# EAGLE schematic cape (EAGLE 9.4.2)
Recording and Emulation of Energy Harvesting Traces

## Sheet 1 of 8
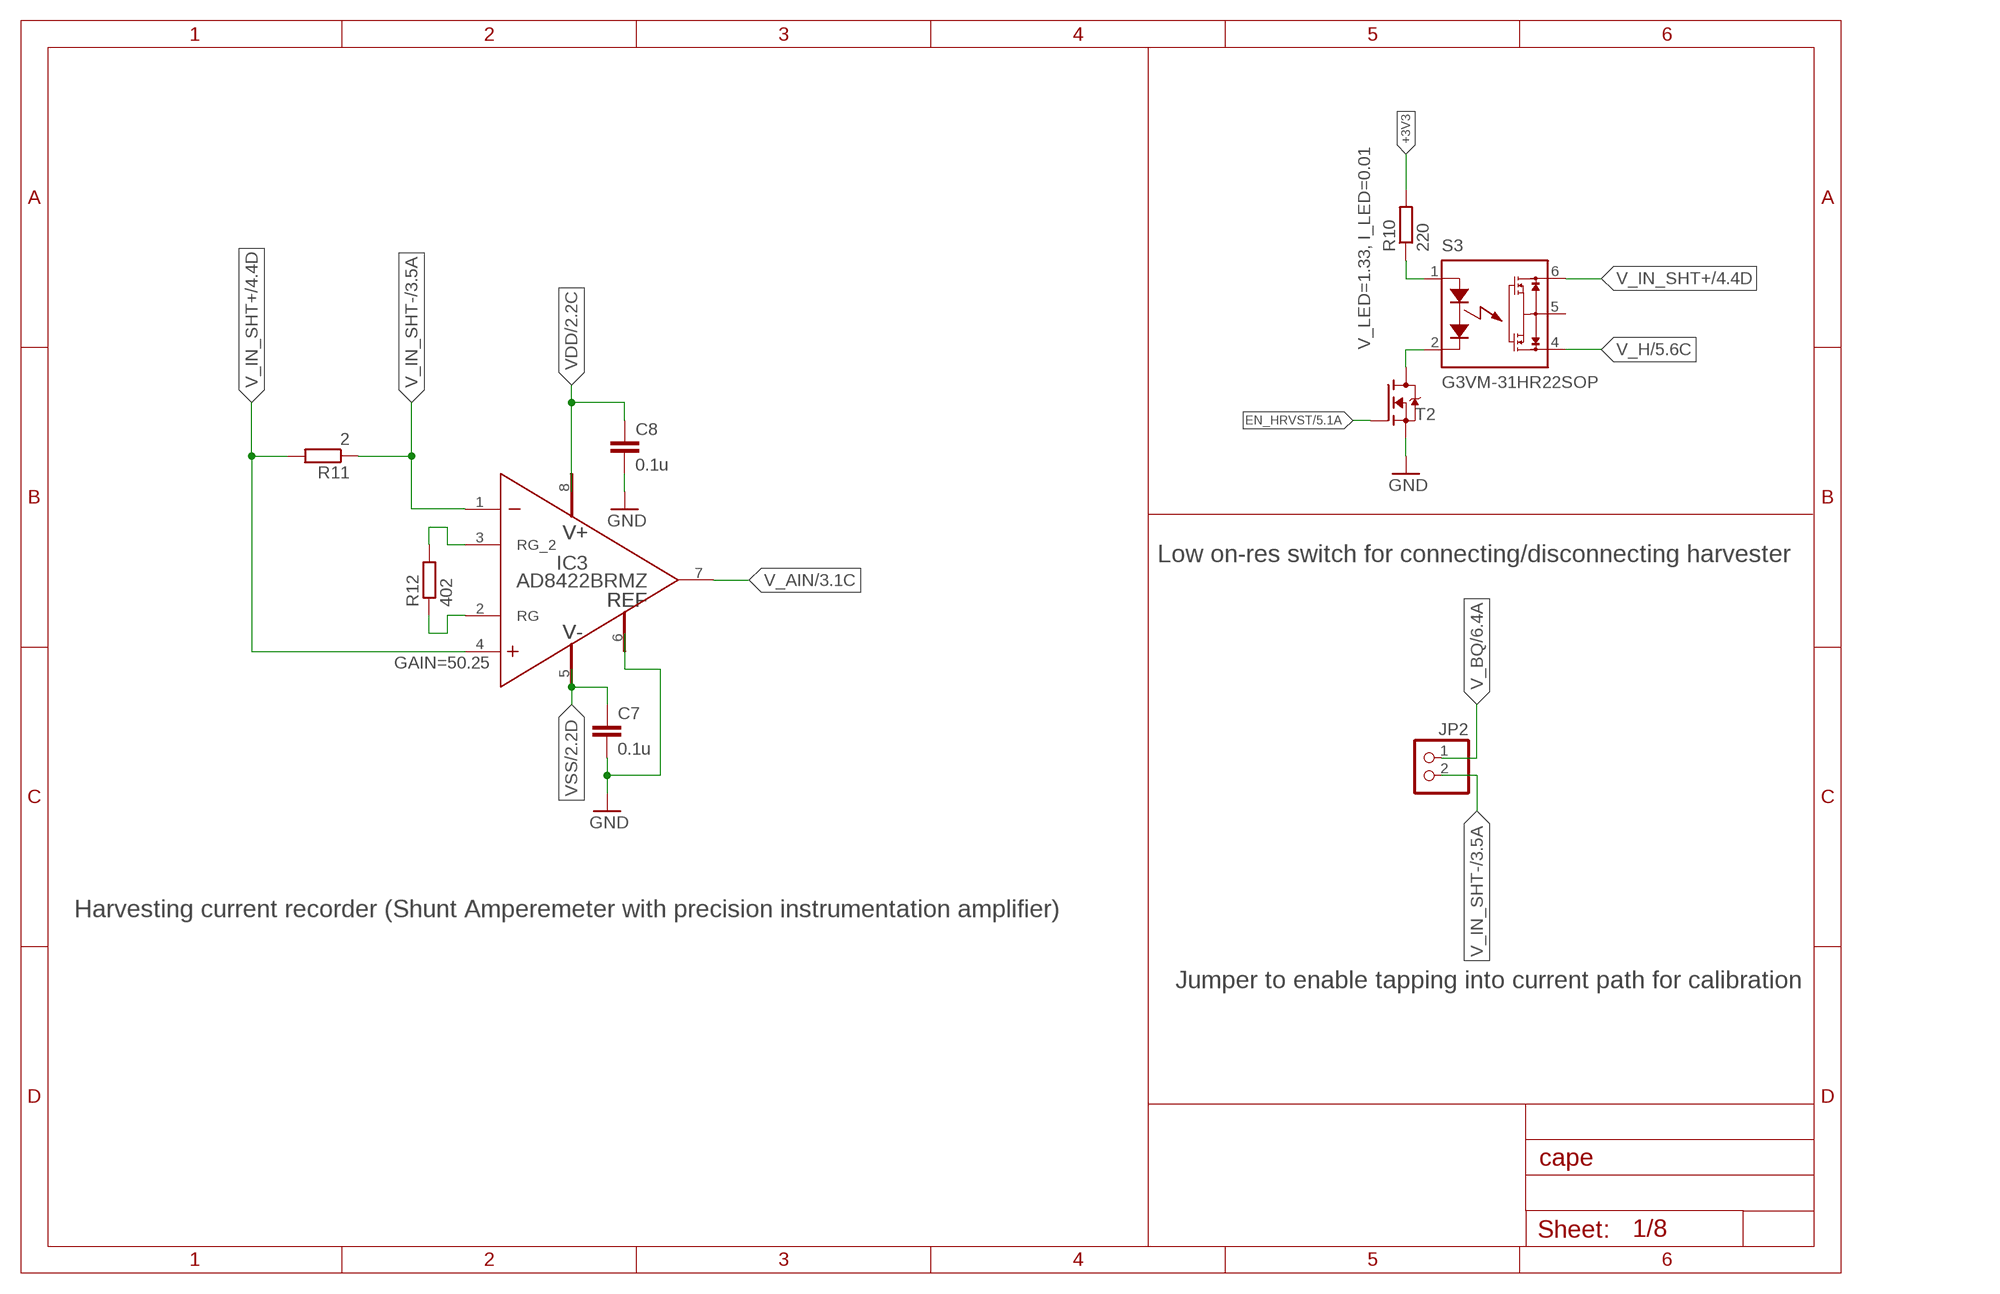
[diagram p0: schematic, sheet 1]

### Parts
C7  0.1u  C_SMD0402  [CAPC1005X55]
C8  0.1u  C_SMD0402  [CAPC1005X55]
IC3  AD8422BRMZ  [RM_8-L]
JP2  PINHD-1X2  [1X02]
R10  220  R_SMD0603  [RESC1608X55]
R11  2  R_SMD0603  [RESC1608X55]
R12  402  R_SMD0603  [RESC1608X55]
S3  G3VM-31HR22SOP  [SOP06]
T2  SI2374DSSOT23-VSHAY  [SOT95P237X112-3]

### Nets
+3V3: R10.2 ; also sheet 2,3,5,7,8
EN_HRVST: T2.1(G) ; also sheet 5
GND: C7.2 C8.2 IC3.6(REF) T2.2(S) ; also sheet 2,3,4,5,6,7,8
N$3: R10.1 S3.1(A)
N$44: IC3.3(RG_2) R12.2
N$45: IC3.2(RG) R12.1
N$52: S3.2(K) T2.3(D)
V_AIN: IC3.7(OUT) ; also sheet 3
V_BQ: JP2.1 ; also sheet 6
V_H: S3.4(D2) ; also sheet 5
V_IN_SHT+: IC3.4(IN+) R11.2 S3.6(D1) ; also sheet 4,5
V_IN_SHT-: IC3.1(IN-) JP2.2 R11.1 ; also sheet 3,5
VDD: C8.1 IC3.8(V+) ; also sheet 2,3,4,6,7,8
VSS: C7.1 IC3.5(V-) ; also sheet 2,4,8
Unconnected: S3.5(S)

### Notes on the sheet
- V_LED=1.33, I_LED=0.01
- Low on-res switch for connecting/disconnecting harvester
- GAIN=50.25
- Harvesting current recorder (Shunt Amperemeter with precision instrumentation amplifier)
- Jumper to enable tapping into current path for calibration

## Sheet 2 of 8
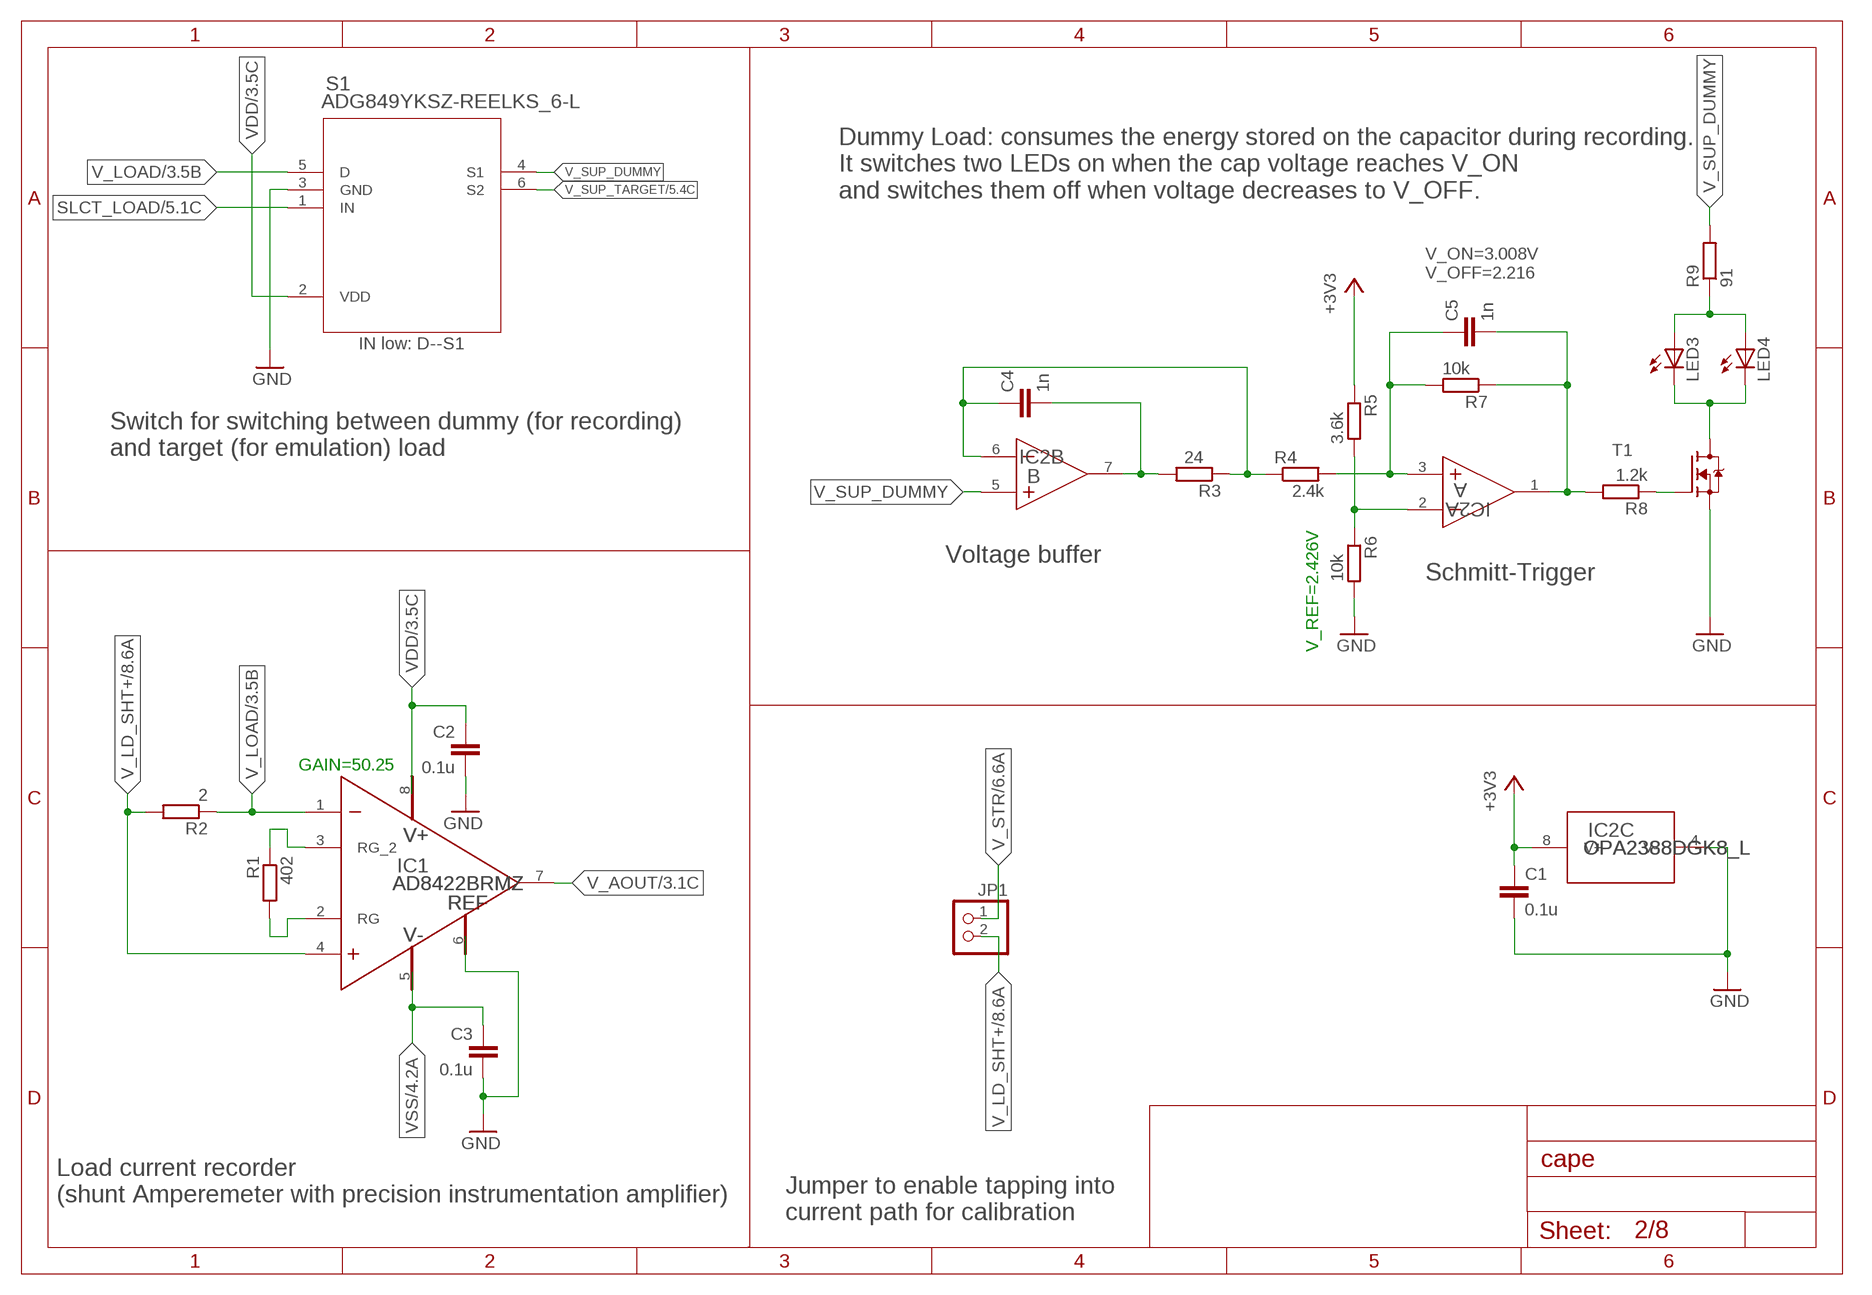
[diagram p1: schematic, sheet 2]

### Parts
C1  0.1u  C_SMD0402  [CAPC1005X55]
C2  0.1u  C_SMD0402  [CAPC1005X55]
C3  0.1u  C_SMD0402  [CAPC1005X55]
C4  1n  C_SMD0402  [CAPC1005X55]
C5  1n  C_SMD0402  [CAPC1005X55]
IC1  AD8422BRMZ  [RM_8-L]
IC2  OPA2388DGK8_L  [DGK8-L]
JP1  PINHD-1X2  [1X02]
LED3  598-8130-107FLED_0805  [LEDC2012X75]
LED4  598-8130-107FLED_0805  [LEDC2012X75]
R1  402  R_SMD0603  [RESC1608X55]
R2  2  R_SMD0603  [RESC1608X55]
R3  24  R_SMD0402  [RESC1005X40]
R4  2.4k  R_SMD0402  [RESC1005X40]
R5  3.6k  R_SMD0402  [RESC1005X40]
R6  10k  R_SMD0402  [RESC1005X40]
R7  10k  R_SMD0402  [RESC1005X40]
R8  1.2k  R_SMD0402  [RESC1005X40]
R9  91  R_SMD0603  [RESC1608X55]
S1  ADG849YKSZ-REELKS_6-L  [KS_6-L]
T1  SI2374DSSOT23-VSHAY  [SOT95P237X112-3]

### Nets
+3V3: C1.1 IC2.8(C:V+) R5.1 ; also sheet 1,3,5,7,8
GND: C1.2 C2.2 C3.2 IC1.6(REF) IC2.4(C:V-) R6.2 S1.3(GND) T1.2(S) ; also sheet 1,3,4,5,6,7,8
N$1: R8.1 T1.1(G)
N$2: LED3.2(A) LED4.2(A) R9.1
N$4: C5.2 IC2.1(A:OUT) R7.1 R8.2
N$13: LED3.1(C) LED4.1(C) T1.3(D)
N$18: C5.1 IC2.3(A:IN+) R4.2 R7.2
N$22: IC2.2(A:IN-) R5.2 R6.1
N$24: C4.1 IC2.6(B:IN-) R3.1 R4.1
N$25: C4.2 IC2.7(B:OUT) R3.2
N$29: IC1.2(RG) R1.2
N$31: IC1.3(RG_2) R1.1
SLCT_LOAD: S1.1(IN) ; also sheet 5
V_AOUT: IC1.7(OUT) ; also sheet 3
V_LD_SHT+: IC1.4(IN+) JP1.2 R2.2 ; also sheet 8
V_LOAD: IC1.1(IN-) R2.1 S1.5(D) ; also sheet 3
V_STR: JP1.1 ; also sheet 6
V_SUP_DUMMY: IC2.5(B:IN+) R9.2 S1.4(S1)
V_SUP_TARGET: S1.6(S2) ; also sheet 5,7
VDD: C2.1 IC1.8(V+) S1.2(VDD) ; also sheet 1,3,4,6,7,8
VSS: C3.1 IC1.5(V-) ; also sheet 1,4,8

### Notes on the sheet
- Dummy Load: consumes the energy stored on the capacitor during recording.
  It switches two LEDs on when the cap voltage reaches V_ON
  and switches them off when voltage decreases to V_OFF.
- V_ON=3.008V
  V_OFF=2.216
- IN low: D--S1
- Switch for switching between dummy (for recording)
  and target (for emulation) load
- Voltage buffer
- Schmitt-Trigger
- V_REF=2.426V
- GAIN=50.25
- Load current recorder
  (shunt Amperemeter with precision instrumentation amplifier)
- Jumper to enable tapping into
  current path for calibration

## Sheet 3 of 8
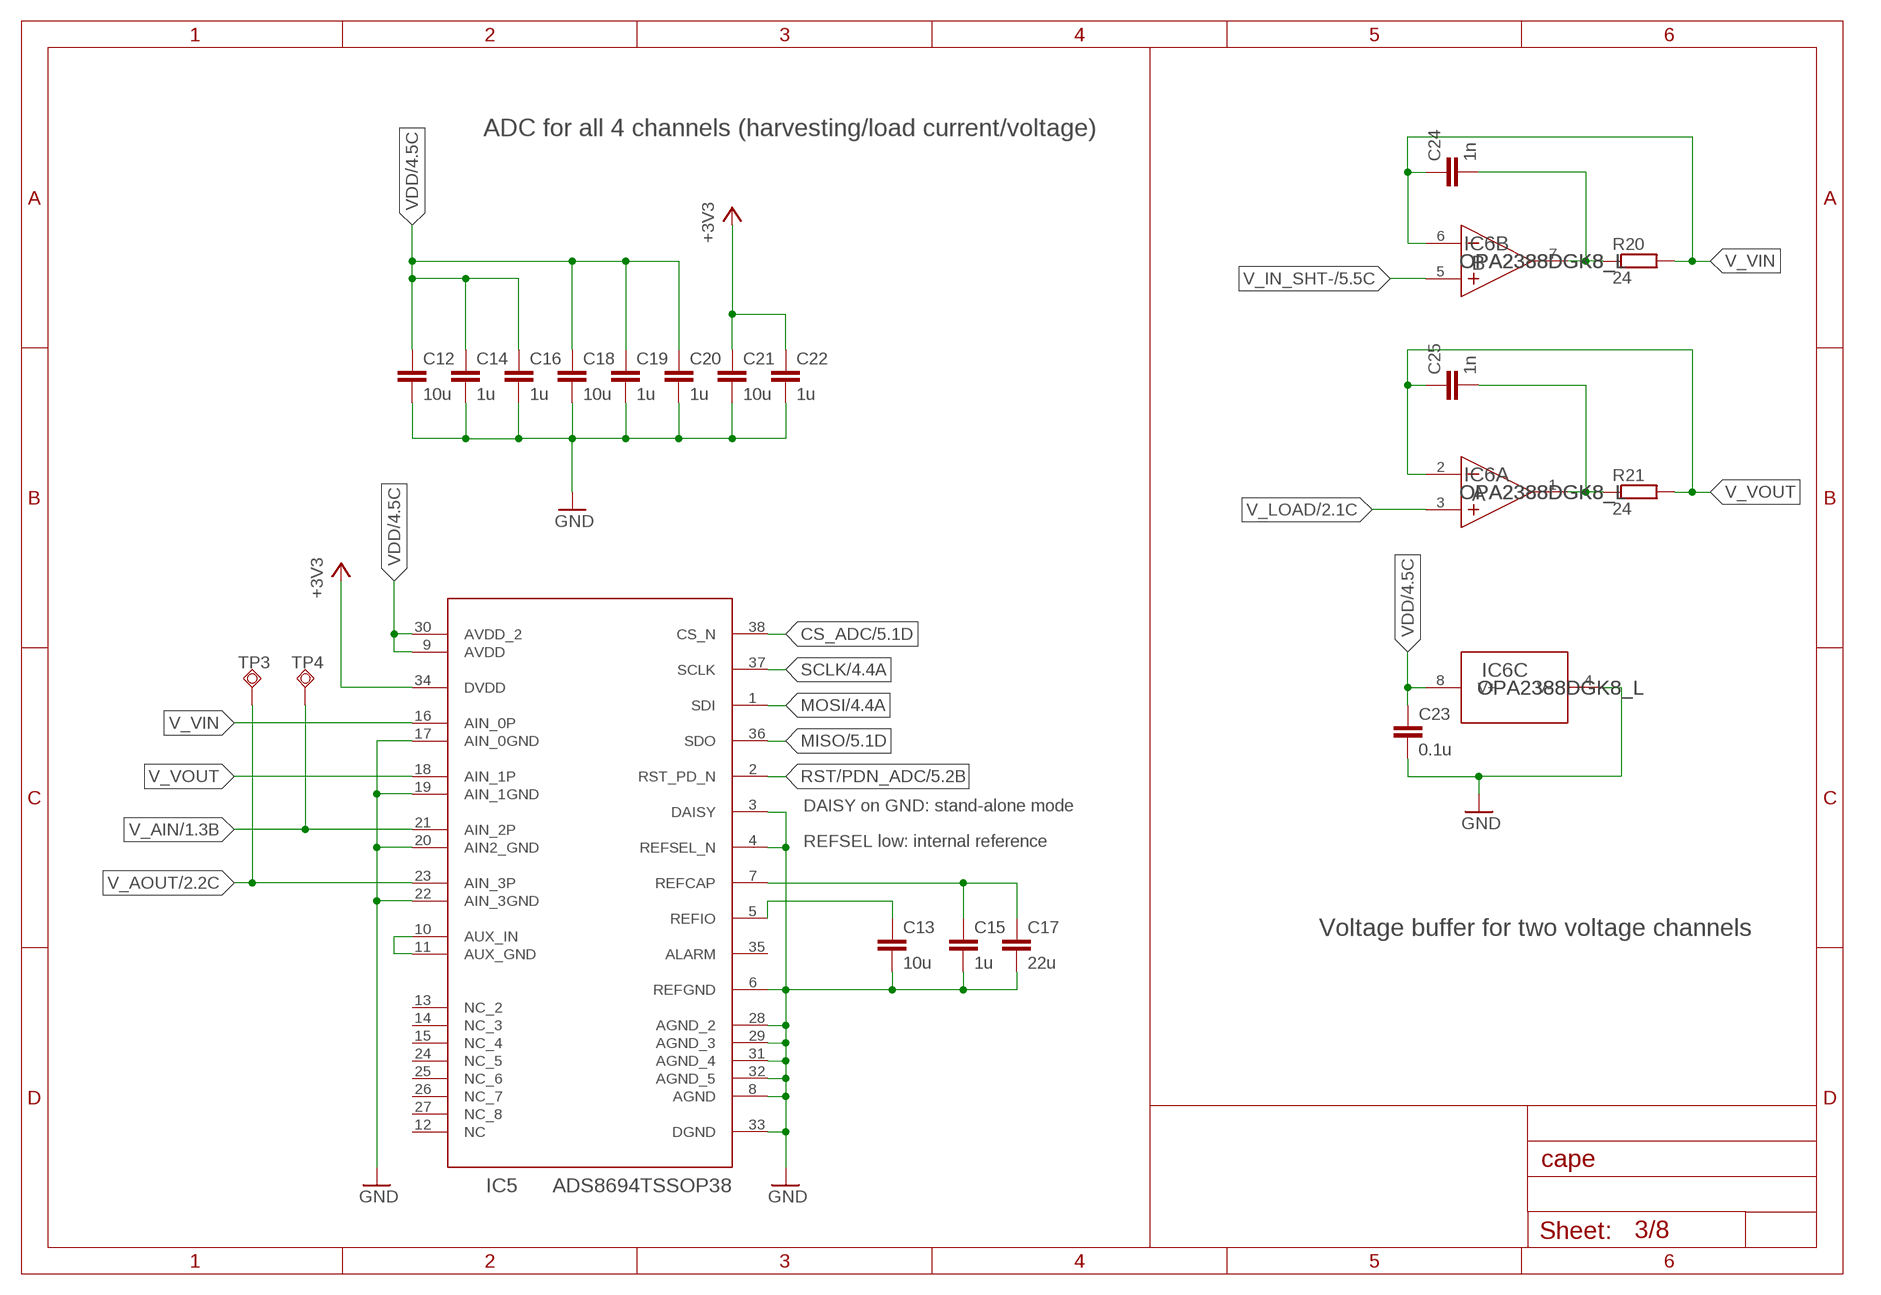
[diagram p2: schematic, sheet 3]

### Parts
C12  10u  C_SMD0805  [CAPC2012X145]
C13  10u  C_SMD0805  [CAPC2012X145]
C14  1u  C_SMD0603  [CAPC1608X95]
C15  1u  C_SMD0603  [CAPC1608X95]
C16  1u  C_SMD0603  [CAPC1608X95]
C17  22u  C_SMD1210  [CAPC3225X280]
C18  10u  C_SMD0805  [CAPC2012X145]
C19  1u  C_SMD0603  [CAPC1608X95]
C20  1u  C_SMD0603  [CAPC1608X95]
C21  10u  C_SMD0805  [CAPC2012X145]
C22  1u  C_SMD0603  [CAPC1608X95]
C23  0.1u  C_SMD0402  [CAPC1005X55]
C24  1n  C_SMD0402  [CAPC1005X55]
C25  1n  C_SMD0402  [CAPC1005X55]
IC5  ADS8694TSSOP38  [TSSOP38]
IC6  OPA2388DGK8_L  [DGK8-L]
R20  24  R_SMD0402  [RESC1005X40]
R21  24  R_SMD0402  [RESC1005X40]
TP3  TPSQTP06R  [TP06R]
TP4  TPSQTP06R  [TP06R]

### Nets
+3V3: C21.1 C22.1 IC5.34(DVDD) ; also sheet 1,2,5,7,8
CS_ADC: IC5.38(CS_N) ; also sheet 5
GND: C12.2 C13.2 C14.2 C15.2 C16.2 C17.2 C18.2 C19.2 C20.2 C21.2 C22.2 C23.2 IC5.3(DAISY) IC5.4(REFSEL_N) IC5.6(REFGND) IC5.8(AGND) IC5.17(AIN_0GND) IC5.19(AIN_1GND) IC5.20(AIN2_GND) IC5.22(AIN_3GND) IC5.28(AGND_2) IC5.29(AGND_3) IC5.31(AGND_4) IC5.32(AGND_5) IC5.33(DGND) IC6.4(C:V-) ; also sheet 1,2,4,5,6,7,8
MISO: IC5.36(SDO) ; also sheet 5
MOSI: IC5.1(SDI) ; also sheet 4,5
N$10: C13.1 IC5.5(REFIO)
N$12: C15.1 C17.1 IC5.7(REFCAP)
N$15: IC5.10(AUX_IN) IC5.11(AUX_GND)
N$42: C25.2 IC6.1(A:OUT) R21.1
N$49: C24.2 IC6.7(B:OUT) R20.1
RST/PDN_ADC: IC5.2(RST_PD_N) ; also sheet 5
SCLK: IC5.37(SCLK) ; also sheet 4,5
V_AIN: IC5.21(AIN_2P) TP4.TP ; also sheet 1
V_AOUT: IC5.23(AIN_3P) TP3.TP ; also sheet 2
V_IN_SHT-: IC6.5(B:IN+) ; also sheet 1,5
V_LOAD: IC6.3(A:IN+) ; also sheet 2
V_VIN: C24.1 IC5.16(AIN_0P) IC6.6(B:IN-) R20.2
V_VOUT: C25.1 IC5.18(AIN_1P) IC6.2(A:IN-) R21.2
VDD: C12.1 C14.1 C16.1 C18.1 C19.1 C20.1 C23.1 IC5.9(AVDD) IC5.30(AVDD_2) IC6.8(C:V+) ; also sheet 1,2,4,6,7,8
Unconnected: IC5.12(NC) IC5.13(NC_2) IC5.14(NC_3) IC5.15(NC_4) IC5.24(NC_5) IC5.25(NC_6) IC5.26(NC_7) IC5.27(NC_8) IC5.35(ALARM)

### Notes on the sheet
- ADC for all 4 channels (harvesting/load current/voltage)
- DAISY on GND: stand-alone mode
- REFSEL low: internal reference
- Voltage buffer for two voltage channels

## Sheet 4 of 8
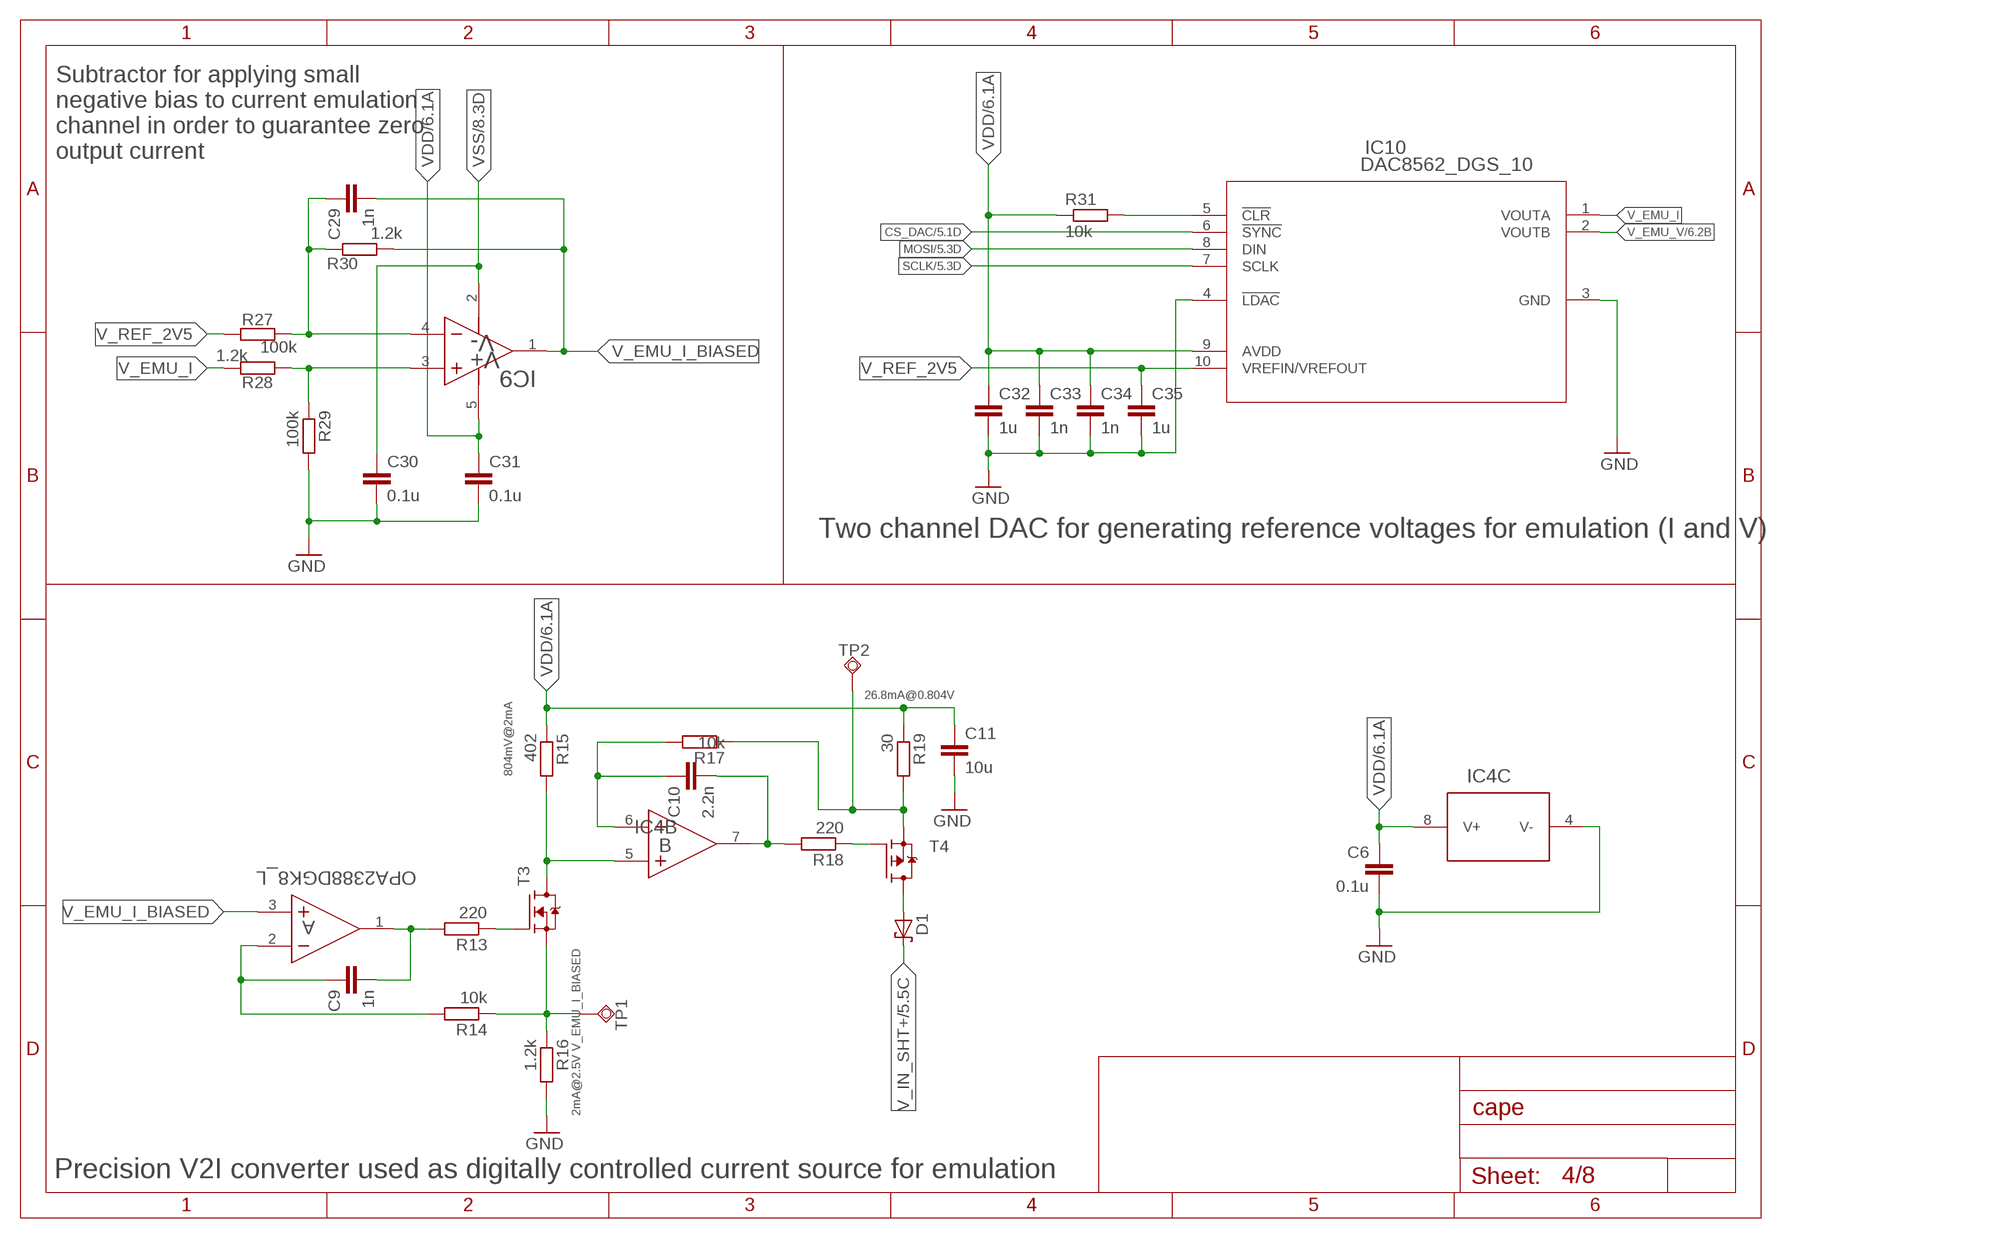
[diagram p3: schematic, sheet 4]

### Parts
C6  0.1u  C_SMD0402  [CAPC1005X55]
C9  1n  C_SMD0402  [CAPC1005X55]
C10  2.2n  C_SMD0402  [CAPC1005X55]
C11  10u  C_SMD0805  [CAPC2012X145]
C29  1n  C_SMD0402  [CAPC1005X55]
C30  0.1u  C_SMD0402  [CAPC1005X55]
C31  0.1u  C_SMD0402  [CAPC1005X55]
C32  1u  C_SMD0603  [CAPC1608X95]
C33  1n  C_SMD0402  [CAPC1005X55]
C34  1n  C_SMD0402  [CAPC1005X55]
C35  1u  C_SMD0603  [CAPC1608X95]
D1  BAT43WS-HE3SOD-323  [SOD2513X110]
IC4  OPA2388DGK8_L  [DGK8-L]
IC9  LMP7701MF  [DBV5-L]
IC10  DAC8562_DGS_10  [DGS10]
R13  220  R_SMD0603  [RESC1608X55]
R14  10k  R_SMD0402  [RESC1005X40]
R15  402  R_SMD0603  [RESC1608X55]
R16  1.2k  R_SMD0402  [RESC1005X40]
R17  10k  R_SMD0402  [RESC1005X40]
R18  220  R_SMD0603  [RESC1608X55]
R19  30  R_SMD0402  [RESC1005X40]
R27  100k  R_SMD0402  [RESC1005X40]
R28  1.2k  R_SMD0402  [RESC1005X40]
R29  100k  R_SMD0402  [RESC1005X40]
R30  1.2k  R_SMD0402  [RESC1005X40]
R31  10k  R_SMD0402  [RESC1005X40]
T3  SI2374DSSOT23-VSHAY  [SOT95P237X112-3]
T4  SI2307SOT23-VSHAY  [SOT95P237X112-3]
TP1  TPSQTP06R  [TP06R]
TP2  TPSQTP06R  [TP06R]

### Nets
CS_DAC: IC10.6(!SYNC) ; also sheet 5
GND: C6.2 C11.2 C30.2 C31.2 C32.2 C33.2 C34.2 C35.2 IC4.4(C:V-) IC10.3(GND) IC10.4(!LDAC) R16.2 R29.2 ; also sheet 1,2,3,5,6,7,8
MOSI: IC10.8(DIN) ; also sheet 3,5
N$8: C9.2 IC4.1(A:OUT) R13.2
N$9: C9.1 IC4.2(A:IN-) R14.2
N$20: IC10.5(!CLR) R31.2
N$39: D1.2(A) T4.3(D)
N$48: C29.1 IC9.4(IN-) R27.1 R30.2
N$54: IC9.3(IN+) R28.1 R29.1
N$57: R13.1 T3.1(G)
N$58: R14.1 R16.1 T3.2(S) TP1.TP
N$59: IC4.5(B:IN+) R15.2 T3.3(D)
N$60: C10.1 IC4.6(B:IN-) R17.2
N$61: C10.2 IC4.7(B:OUT) R18.2
N$62: R18.1 T4.1(G)
N$63: R17.1 R19.2 T4.2(S) TP2.TP
SCLK: IC10.7(SCLK) ; also sheet 3,5
V_EMU_I: IC10.1(VOUTA) R28.2
V_EMU_I_BIASED: C29.2 IC4.3(A:IN+) IC9.1(OUT) R30.1
V_EMU_V: IC10.2(VOUTB) ; also sheet 6
V_IN_SHT+: D1.1(C) ; also sheet 1,5
V_REF_2V5: C35.1 IC10.10(VREFIN/VREFOUT) R27.2
VDD: C6.1 C11.1 C31.1 C32.1 C33.1 C34.1 IC4.8(C:V+) IC9.5(V+) IC10.9(AVDD) R15.1 R19.1 R31.1 ; also sheet 1,2,3,6,7,8
VSS: C30.1 IC9.2(V-) ; also sheet 1,2,8

### Notes on the sheet
- Subtractor for applying small
  negative bias to current emulation
  channel in order to guarantee zero
  output current
- Two channel DAC for generating reference voltages for emulation (I and V)
- 26.8mA@0.804V
- 804mV@2mA
- 2mA@2.5V V_EMU_I_BIASED
- Precision V2I converter used as digitally controlled current source for emulation

## Sheet 5 of 8
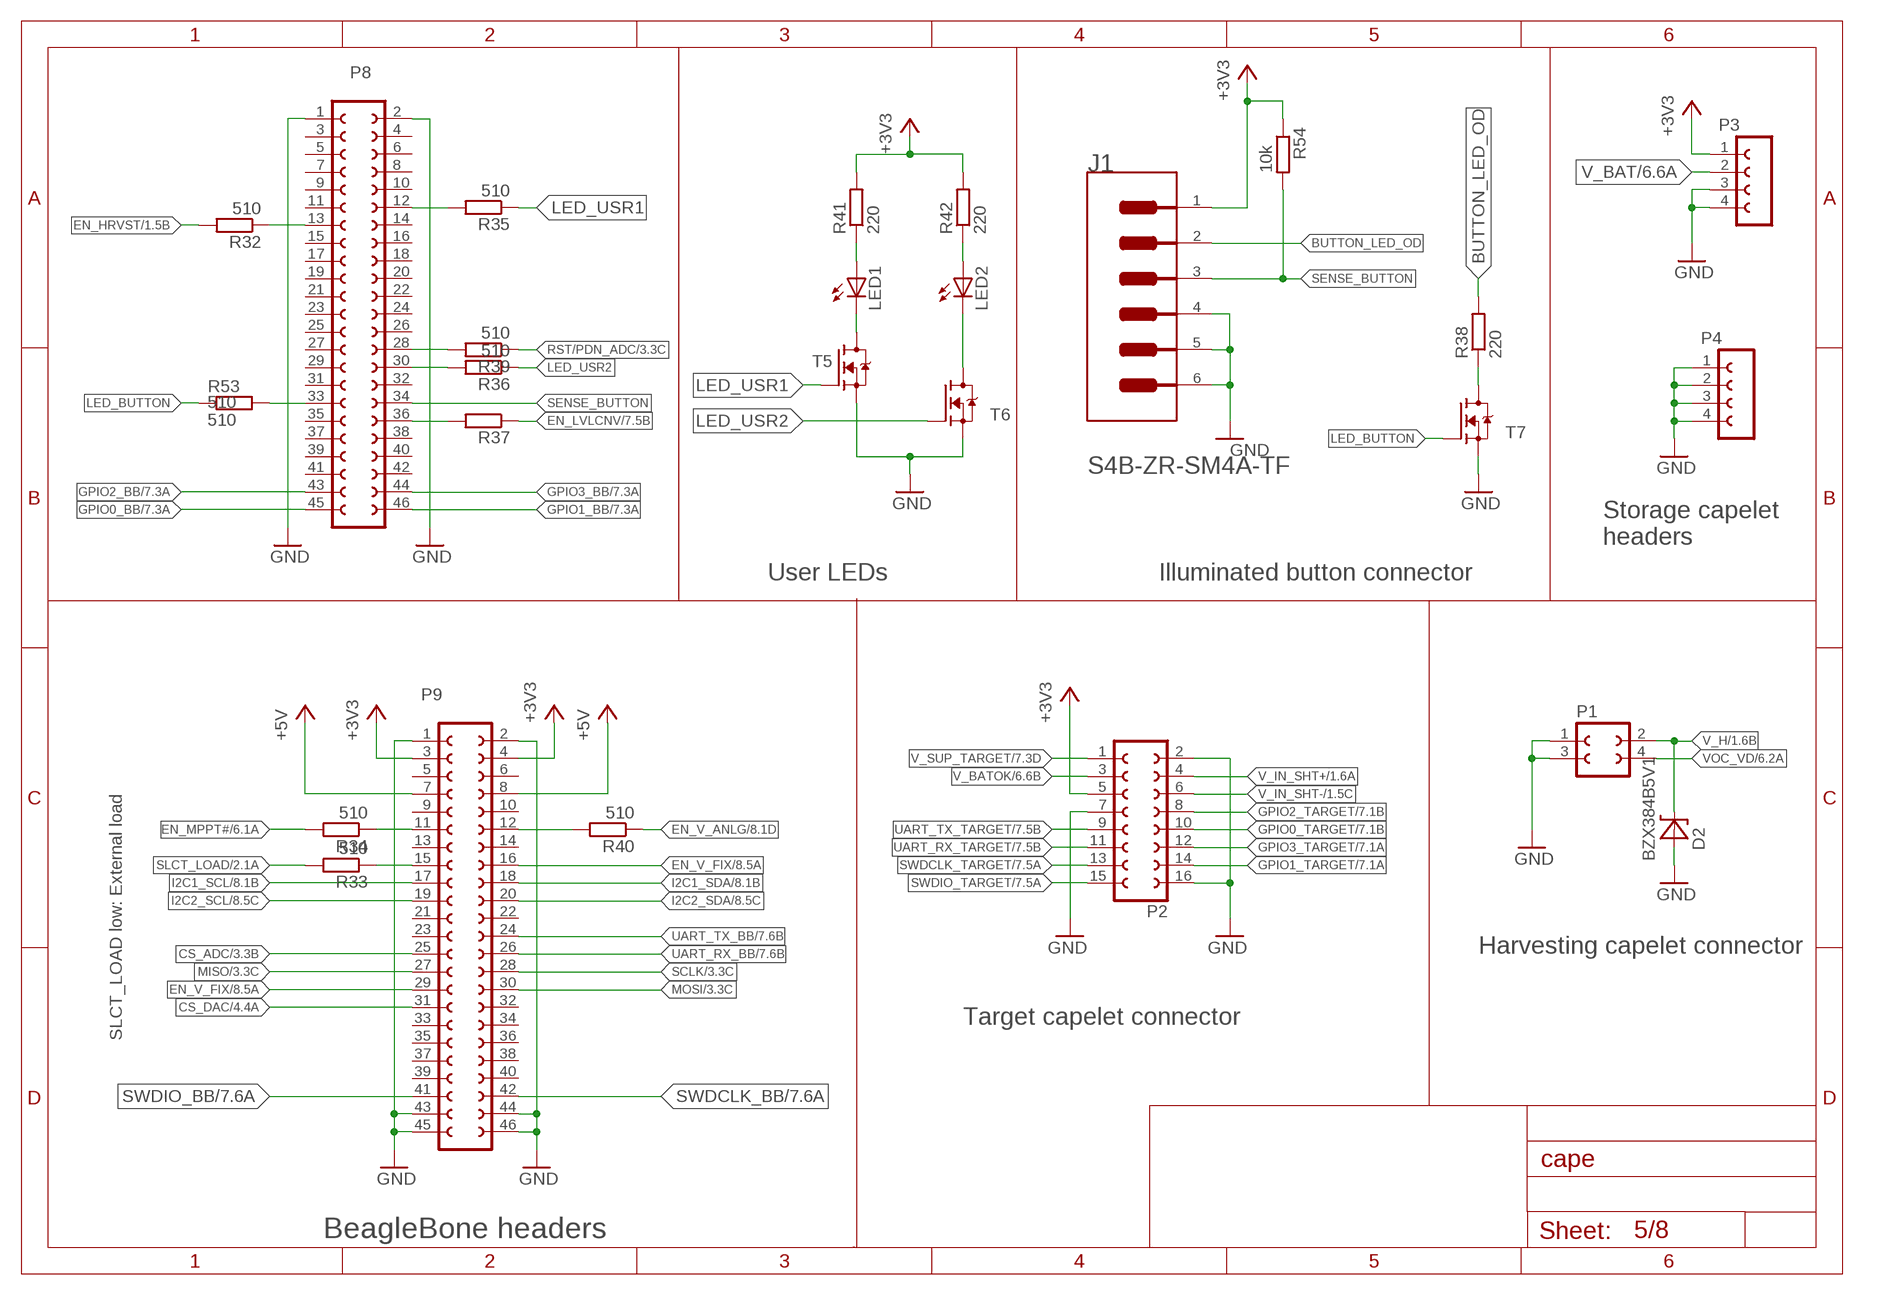
[diagram p4: schematic, sheet 5]

### Parts
D2  BZX384B5V1  [SOD2513X110]
J1  JST_S4B-ZR-SM4A-TFJST_S4B-ZR-SM4A-TF_0_0  [JST_S4B-ZR-SM4A-TF_0]
LED1  598-8130-107FLED_0805  [LEDC2012X75]
LED2  598-8130-107FLED_0805  [LEDC2012X75]
P1  FE02-2  [FE02-2]
P2  FE08-2  [FE08-2]
P3  FE04-1  [FE04-1]
P4  FE04-1  [FE04-1]
P8  FE23-2  [FE23-2]
P9  FE23-2  [FE23-2]
R32  510  R_SMD0402  [RESC1005X40]
R33  510  R_SMD0402  [RESC1005X40]
R34  510  R_SMD0402  [RESC1005X40]
R35  510  R_SMD0402  [RESC1005X40]
R36  510  R_SMD0402  [RESC1005X40]
R37  510  R_SMD0402  [RESC1005X40]
R38  220  R_SMD0603  [RESC1608X55]
R39  510  R_SMD0402  [RESC1005X40]
R40  510  R_SMD0402  [RESC1005X40]
R41  220  R_SMD0603  [RESC1608X55]
R42  220  R_SMD0603  [RESC1608X55]
R53  510  R_SMD0402  [RESC1005X40]
R54  10k  R_SMD0402  [RESC1005X40]
T5  SI2374DSSOT23-VSHAY  [SOT95P237X112-3]
T6  SI2374DSSOT23-VSHAY  [SOT95P237X112-3]
T7  SI2374DSSOT23-VSHAY  [SOT95P237X112-3]

### Nets
+3V3: J1.1 P2.5 P3.1 P9.3 P9.4 R41.2 R42.2 R54.1 ; also sheet 1,2,3,7,8
+5V: P9.7 P9.8 ; also sheet 8
BUTTON_LED_OD: J1.2 R38.2
CS_ADC: P9.25 ; also sheet 3
CS_DAC: P9.31 ; also sheet 4
EN_HRVST: R32.2 ; also sheet 1
EN_LVLCNV: R37.1 ; also sheet 7
EN_MPPT#: R34.2 ; also sheet 6
EN_V_ANLG: R40.1 ; also sheet 8
EN_V_FIX: P9.16 P9.29 ; also sheet 8
GND: D2.2(A) J1.4 J1.5(MNT_1) J1.6(MNT_2) P1.1 P1.3 P2.2 P2.7 P2.16 P3.3 P3.4 P4.1 P4.2 P4.3 P4.4 P8.1 P8.2 P9.1 P9.2 P9.43 P9.44 P9.45 P9.46 T5.2(S) T6.2(S) T7.2(S) ; also sheet 1,2,3,4,6,7,8
GPIO0_BB: P8.45 ; also sheet 7
GPIO0_TARGET: P2.10 ; also sheet 7
GPIO1_BB: P8.46 ; also sheet 7
GPIO1_TARGET: P2.14 ; also sheet 7
GPIO2_BB: P8.43 ; also sheet 7
GPIO2_TARGET: P2.8 ; also sheet 7
GPIO3_BB: P8.44 ; also sheet 7
GPIO3_TARGET: P2.12 ; also sheet 7
I2C1_SCL: P9.17 ; also sheet 8
I2C1_SDA: P9.18 ; also sheet 8
I2C2_SCL: P9.19 ; also sheet 8
I2C2_SDA: P9.20 ; also sheet 8
LED_BUTTON: R53.1 T7.1(G)
LED_USR1: R35.1 T5.1(G)
LED_USR2: R36.1 T6.1(G)
MISO: P9.27 ; also sheet 3
MOSI: P9.30 ; also sheet 3,4
N$5: LED1.1(C) T5.3(D)
N$6: P8.13 R32.1
N$14: P9.15 R33.1
N$27: P8.28 R39.2
N$28: P8.33 R53.2
N$30: P8.36 R37.2
N$32: LED1.2(A) R41.1
N$34: P8.12 R35.2
N$35: LED2.1(C) T6.3(D)
N$36: LED2.2(A) R42.1
N$37: P9.11 R34.1
N$38: P8.30 R36.2
N$53: R38.1 T7.3(D)
N$103: P9.12 R40.2
RST/PDN_ADC: R39.1 ; also sheet 3
SCLK: P9.28 ; also sheet 3,4
SENSE_BUTTON: J1.3 P8.34 R54.2
SLCT_LOAD: R33.2 ; also sheet 2
SWDCLK_BB: P9.42 ; also sheet 7
SWDCLK_TARGET: P2.13 ; also sheet 7
SWDIO_BB: P9.41 ; also sheet 7
SWDIO_TARGET: P2.15 ; also sheet 7
UART_RX_BB: P9.26 ; also sheet 7
UART_RX_TARGET: P2.11 ; also sheet 7
UART_TX_BB: P9.24 ; also sheet 7
UART_TX_TARGET: P2.9 ; also sheet 7
V_BAT: P3.2 ; also sheet 6
V_BATOK: P2.3 ; also sheet 6
V_H: D2.1(C) P1.2 ; also sheet 1
V_IN_SHT+: P2.4 ; also sheet 1,4
V_IN_SHT-: P2.6 ; also sheet 1,3
V_SUP_TARGET: P2.1 ; also sheet 2,7
VOC_VD: P1.4 ; also sheet 6
Unconnected: P8.3 P8.4 P8.5 P8.6 P8.7 P8.8 P8.9 P8.10 P8.11 P8.14 P8.15 P8.16 P8.17 P8.18 P8.19 P8.20 P8.21 P8.22 P8.23 P8.24 P8.25 P8.26 P8.27 P8.29 P8.31 P8.32 P8.35 P8.37 P8.38 P8.39 P8.40 P8.41 P8.42 P9.5 P9.6 P9.9 P9.10 P9.13 P9.14 P9.21 P9.22 P9.23 P9.32 P9.33 P9.34 P9.35 P9.36 P9.37 P9.38 P9.39 P9.40

### Notes on the sheet
- Storage capelet
  headers
- User LEDs | Illuminated button connector
- SLCT_LOAD low: External load
- Harvesting capelet connector
- Target capelet connector
- BeagleBone headers

## Sheet 6 of 8
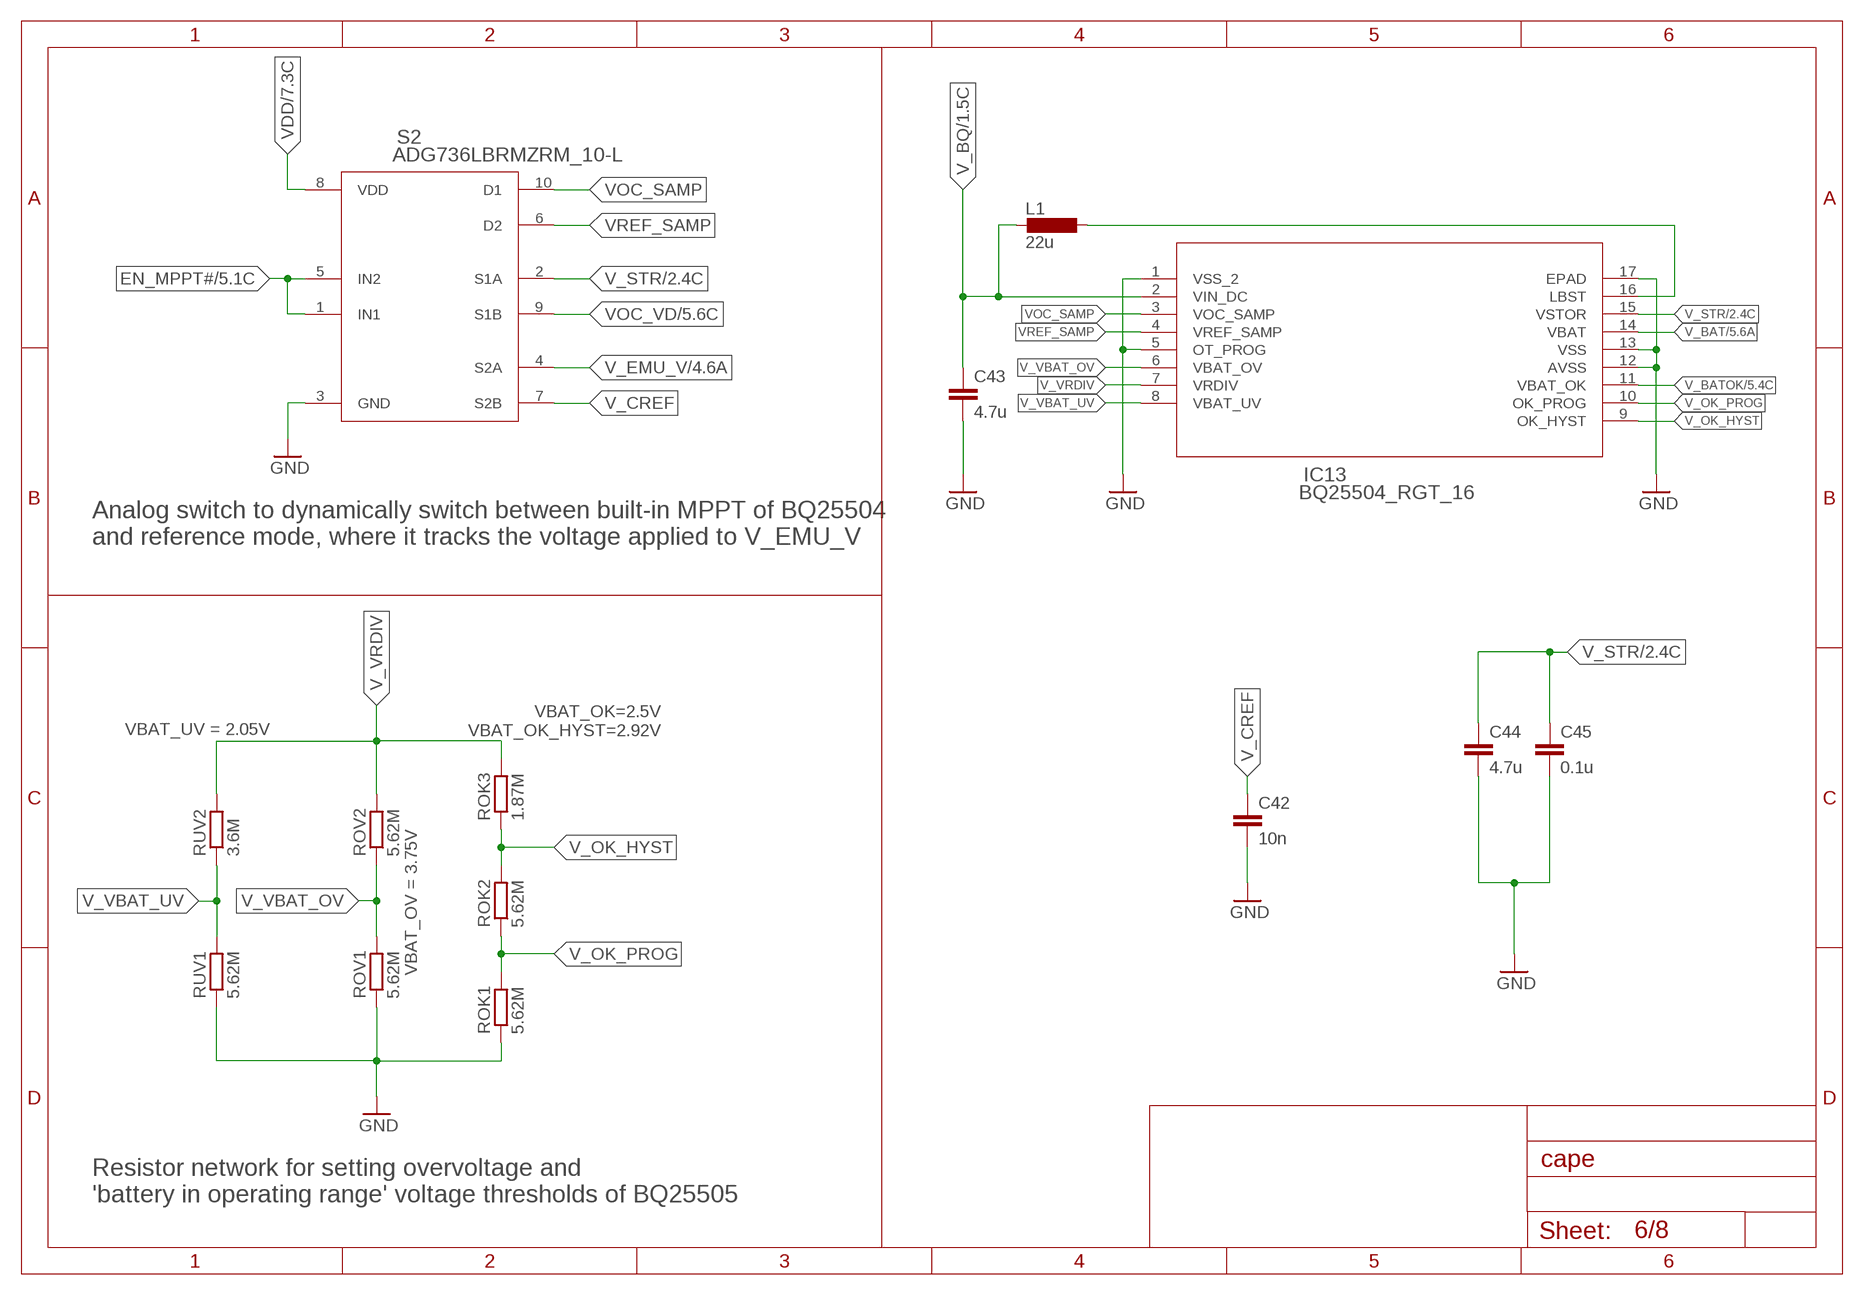
[diagram p5: schematic, sheet 6]

### Parts
C42  10n  C_SMD0402  [CAPC1005X55]
C43  4.7u  C_SMD0805  [CAPC2012X145]
C44  4.7u  C_SMD0805  [CAPC2012X145]
C45  0.1u  C_SMD0402  [CAPC1005X55]
IC13  BQ25504_RGT_16  [RGT16_1P7X1P7]
L1  22u  L-EUL3225P  [L3225P]
ROK1  5.62M  R_SMD0603  [RESC1608X55]
ROK2  5.62M  R_SMD0603  [RESC1608X55]
ROK3  1.87M  R_SMD0603  [RESC1608X55]
ROV1  5.62M  R_SMD0603  [RESC1608X55]
ROV2  5.62M  R_SMD0603  [RESC1608X55]
RUV1  5.62M  R_SMD0603  [RESC1608X55]
RUV2  3.6M  R_SMD0603  [RESC1608X55]
S2  ADG736LBRMZRM_10-L  [RM_10-L]

### Nets
EN_MPPT#: S2.1(IN1) S2.5(IN2) ; also sheet 5
GND: C42.2 C43.2 C44.2 C45.2 IC13.1(VSS_2) IC13.5(OT_PROG) IC13.12(AVSS) IC13.13(VSS) IC13.17(EPAD) ROK1.1 ROV1.1 RUV1.1 S2.3(GND) ; also sheet 1,2,3,4,5,7,8
N$19: IC13.16(LBST) L1.1
V_BAT: IC13.14(VBAT) ; also sheet 5
V_BATOK: IC13.11(VBAT_OK) ; also sheet 5
V_BQ: C43.1 IC13.2(VIN_DC) L1.2 ; also sheet 1
V_CREF: C42.1 S2.7(S2B)
V_EMU_V: S2.4(S2A) ; also sheet 4
V_OK_HYST: IC13.9(OK_HYST) ROK2.2 ROK3.1
V_OK_PROG: IC13.10(OK_PROG) ROK1.2 ROK2.1
V_STR: C44.1 C45.1 IC13.15(VSTOR) S2.2(S1A) ; also sheet 2
V_VBAT_OV: IC13.6(VBAT_OV) ROV1.2 ROV2.1
V_VBAT_UV: IC13.8(VBAT_UV) RUV1.2 RUV2.1
V_VRDIV: IC13.7(VRDIV) ROK3.2 ROV2.2 RUV2.2
VDD: S2.8(VDD) ; also sheet 1,2,3,4,7,8
VOC_SAMP: IC13.3(VOC_SAMP) S2.10(D1)
VOC_VD: S2.9(S1B) ; also sheet 5
VREF_SAMP: IC13.4(VREF_SAMP) S2.6(D2)

### Notes on the sheet
- Analog switch to dynamically switch between built-in MPPT of BQ25504
  and reference mode, where it tracks the voltage applied to V_EMU_V
- VBAT_OK=2.5V
  VBAT_OK_HYST=2.92V
- VBAT_UV = 2.05V
- VBAT_OV = 3.75V
- Resistor network for setting overvoltage and
  'battery in operating range' voltage thresholds of BQ25505

## Sheet 7 of 8
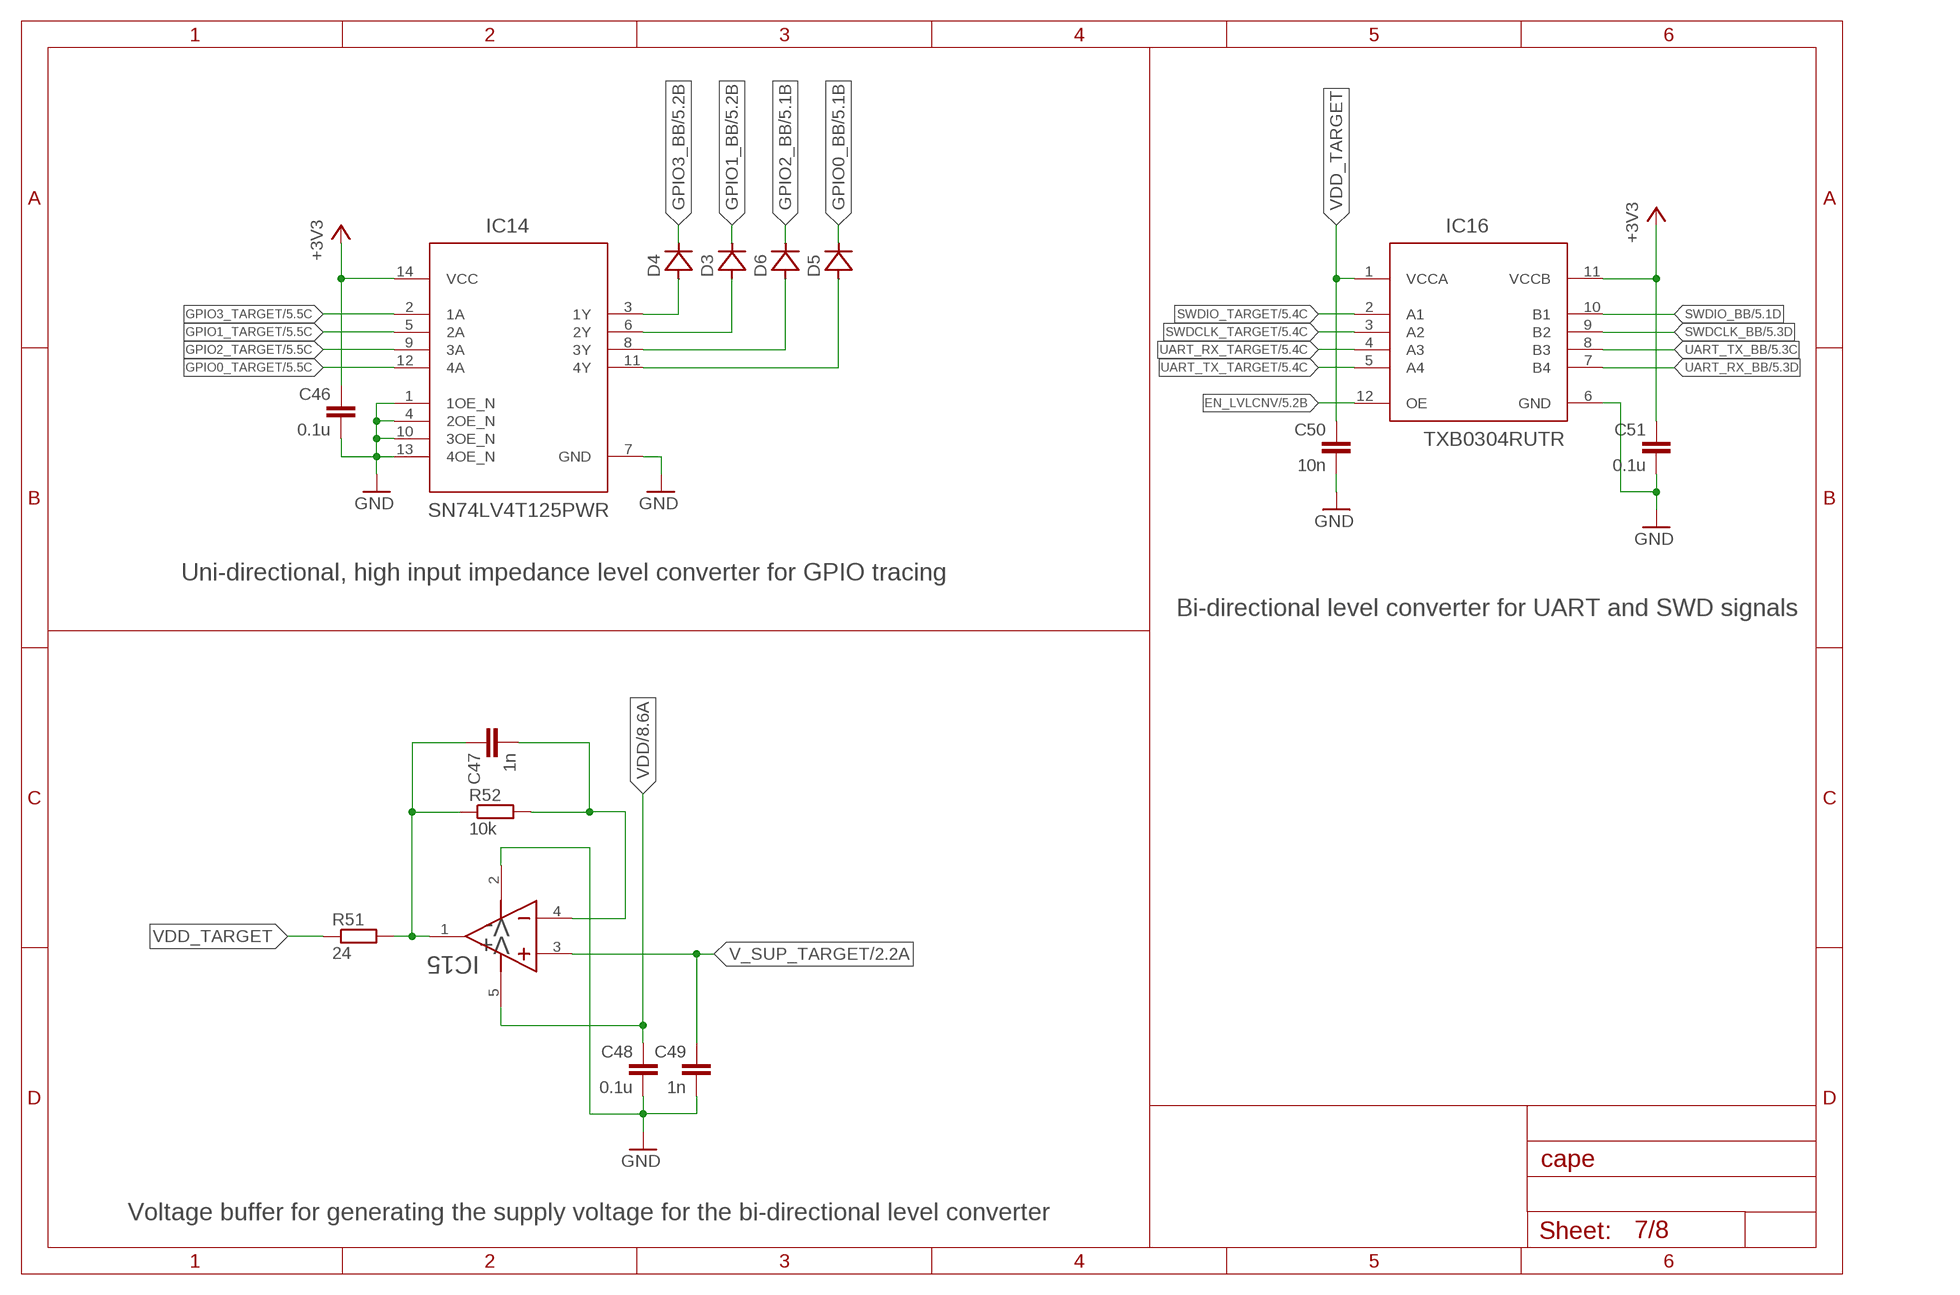
[diagram p6: schematic, sheet 7]

### Parts
C46  0.1u  C_SMD0402  [CAPC1005X55]
C47  1n  C_SMD0402  [CAPC1005X55]
C48  0.1u  C_SMD0402  [CAPC1005X55]
C49  1n  C_SMD0402  [CAPC1005X55]
C50  10n  C_SMD0402  [CAPC1005X55]
C51  0.1u  C_SMD0402  [CAPC1005X55]
D3  ACDBQC0130L-HF0402  [DIOC1005X55N]
D4  ACDBQC0130L-HF0402  [DIOC1005X55N]
D5  ACDBQC0130L-HF0402  [DIOC1005X55N]
D6  ACDBQC0130L-HF0402  [DIOC1005X55N]
IC14  SN74LV4T125PWR  [PW0014A_N]
IC15  LMP7701MF  [DBV5-L]
IC16  TXB0304RUTR  [RUT0012A]
R51  24  R_SMD0402  [RESC1005X40]
R52  10k  R_SMD0402  [RESC1005X40]

### Nets
+3V3: C46.1 C51.1 IC14.14(VCC) IC16.11(VCCB) ; also sheet 1,2,3,5,8
EN_LVLCNV: IC16.12(OE) ; also sheet 5
GND: C46.2 C48.2 C49.2 C50.2 C51.2 IC14.1(1OE_N) IC14.4(2OE_N) IC14.7(GND) IC14.10(3OE_N) IC14.13(4OE_N) IC15.2(V-) IC16.6(GND) ; also sheet 1,2,3,4,5,6,8
GPIO0_BB: D5.2(C) ; also sheet 5
GPIO0_TARGET: IC14.12(4A) ; also sheet 5
GPIO1_BB: D3.2(C) ; also sheet 5
GPIO1_TARGET: IC14.5(2A) ; also sheet 5
GPIO2_BB: D6.2(C) ; also sheet 5
GPIO2_TARGET: IC14.9(3A) ; also sheet 5
GPIO3_BB: D4.2(C) ; also sheet 5
GPIO3_TARGET: IC14.2(1A) ; also sheet 5
N$43: D4.1(A) IC14.3(1Y)
N$46: C47.1 IC15.1(OUT) R51.2 R52.1
N$47: D3.1(A) IC14.6(2Y)
N$50: D6.1(A) IC14.8(3Y)
N$51: D5.1(A) IC14.11(4Y)
N$55: C47.2 IC15.4(IN-) R52.2
SWDCLK_BB: IC16.9(B2) ; also sheet 5
SWDCLK_TARGET: IC16.3(A2) ; also sheet 5
SWDIO_BB: IC16.10(B1) ; also sheet 5
SWDIO_TARGET: IC16.2(A1) ; also sheet 5
UART_RX_BB: IC16.7(B4) ; also sheet 5
UART_RX_TARGET: IC16.4(A3) ; also sheet 5
UART_TX_BB: IC16.8(B3) ; also sheet 5
UART_TX_TARGET: IC16.5(A4) ; also sheet 5
V_SUP_TARGET: C49.1 IC15.3(IN+) ; also sheet 2,5
VDD: C48.1 IC15.5(V+) ; also sheet 1,2,3,4,6,8
VDD_TARGET: C50.1 IC16.1(VCCA) R51.1

### Notes on the sheet
- Uni-directional, high input impedance level converter for GPIO tracing
- Bi-directional level converter for UART and SWD signals
- Voltage buffer for generating the supply voltage for the bi-directional level converter

## Sheet 8 of 8
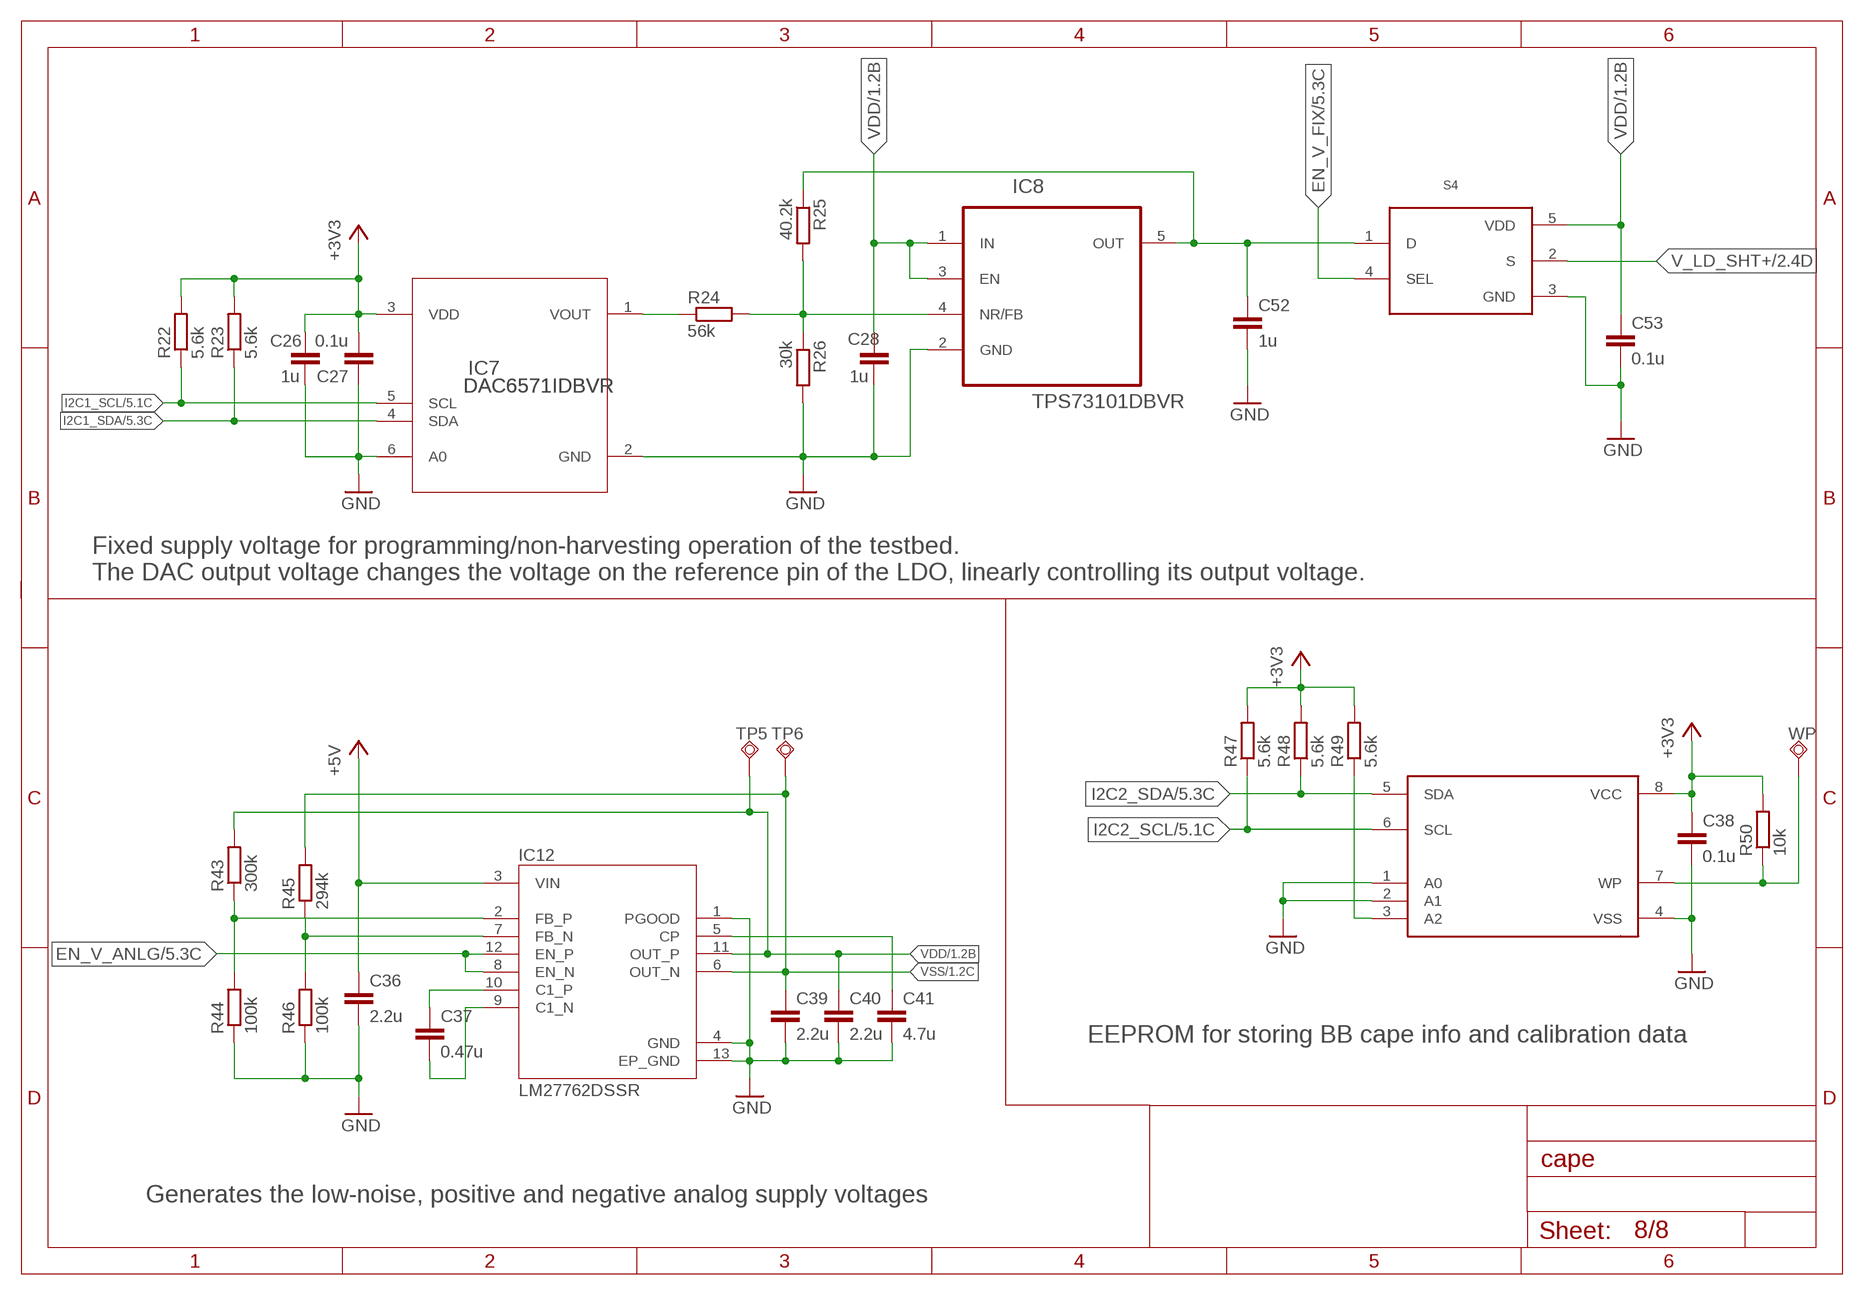
[diagram p7: schematic, sheet 8]

### Parts
C26  1u  C_SMD0603  [CAPC1608X95]
C27  0.1u  C_SMD0402  [CAPC1005X55]
C28  1u  C_SMD0603  [CAPC1608X95]
C36  2.2u  C_SMD0805  [CAPC2012X145]
C37  0.47u  C_SMD0603  [CAPC1608X95]
C38  0.1u  C_SMD0402  [CAPC1005X55]
C39  2.2u  C_SMD0805  [CAPC2012X145]
C40  2.2u  C_SMD0805  [CAPC2012X145]
C41  4.7u  C_SMD0805  [CAPC2012X145]
C52  1u  C_SMD0603  [CAPC1608X95]
C53  0.1u  C_SMD0402  [CAPC1005X55]
IC7  DAC6571IDBVR  [DAC6571IDBVR]
IC8  TPS73101DBVR  [SOT95P280X145-5N]
IC11  CAT24C256WI-GT3  [SO08]
IC12  LM27762DSSR  [VREG_LM27762DSSR]
R22  5.6k  R_SMD0402  [RESC1005X40]
R23  5.6k  R_SMD0402  [RESC1005X40]
R24  56k  R_SMD0402  [RESC1005X40]
R25  40.2k  R_SMD0402  [RESC1005X40]
R26  30k  R_SMD0402  [RESC1005X40]
R43  300k  R_SMD0402  [RESC1005X40]
R44  100k  R_SMD0402  [RESC1005X40]
R45  294k  R_SMD0402  [RESC1005X40]
R46  100k  R_SMD0402  [RESC1005X40]
R47  5.6k  R_SMD0402  [RESC1005X40]
R48  5.6k  R_SMD0402  [RESC1005X40]
R49  5.6k  R_SMD0402  [RESC1005X40]
R50  10k  R_SMD0402  [RESC1005X40]
S4  TMUX1101DCK  [DCK5]
TP5  TPSQTP06R  [TP06R]
TP6  TPSQTP06R  [TP06R]
WP  TPSQTP06R  [TP06R]

### Nets
+3V3: C26.1 C27.2 C38.1 IC7.3(VDD) IC11.8(VCC) R22.2 R23.2 R47.2 R48.2 R49.2 R50.2 ; also sheet 1,2,3,5,7
+5V: C36.1 IC12.3(VIN) ; also sheet 5
EN_V_ANLG: IC12.8(EN_N) IC12.12(EN_P) ; also sheet 5
EN_V_FIX: S4.4(SEL) ; also sheet 5
GND: C26.2 C27.1 C28.2 C36.2 C38.2 C39.2 C40.2 C41.2 C52.2 C53.2 IC7.2(GND) IC7.6(A0) IC8.2(GND) IC11.1(A0) IC11.2(A1) IC11.4(VSS) IC12.1(PGOOD) IC12.4(GND) IC12.13(EP_GND) R26.2 R44.1 R46.1 S4.3(GND) ; also sheet 1,2,3,4,5,6,7
I2C1_SCL: IC7.5(SCL) R22.1 ; also sheet 5
I2C1_SDA: IC7.4(SDA) R23.1 ; also sheet 5
I2C2_SCL: IC11.6(SCL) R47.1 ; also sheet 5
I2C2_SDA: IC11.5(SDA) R48.1 ; also sheet 5
N$7: C52.1 IC8.5(OUT) R25.1 S4.1(D)
N$11: IC8.4(NR/FB) R24.2 R25.2 R26.1
N$16: IC12.2(FB_P) R43.1 R44.2
N$17: IC7.1(VOUT) R24.1
N$21: IC11.7(WP) R50.1 WP.TP
N$23: IC12.7(FB_N) R45.1 R46.2
N$26: IC11.3(A2) R49.1
N$33: C41.1 IC12.5(CP)
N$40: C37.2 IC12.9(C1_N)
N$41: C37.1 IC12.10(C1_P)
V_LD_SHT+: S4.2(S) ; also sheet 2
VDD: C28.1 C40.1 C53.1 IC8.1(IN) IC8.3(EN) IC12.11(OUT_P) R43.2 S4.5(VDD) TP5.TP ; also sheet 1,2,3,4,6,7
VSS: C39.1 IC12.6(OUT_N) R45.2 TP6.TP ; also sheet 1,2,4

### Notes on the sheet
- Fixed supply voltage for programming/non-harvesting operation of the testbed.
  The DAC output voltage changes the voltage on the reference pin of the LDO, linearly controlling its output voltage.
- EEPROM for storing BB cape info and calibration data
- Generates the low-noise, positive and negative analog supply voltages

## Library data of the parts
C1-C51 C53 = mylib:C_SMD
C52 = shepherd:C_SMD
D1 = mylib:BAT43WS-HE3
D2 = mylib:BZX384B5V1
D3-D6 = shepherd:ACDBQC0130L-HF
IC1 IC3 = mylib:AD8422BRMZ
IC2 IC4 IC6 = mylib:OPA2388
IC5 = mylib:ADS8694
IC7 = mylib:DAC6571IDBVR
IC8 = shepherd:TPS73101DBVR: Cap-Free, NMOS, 400mA Low-Dropout Regulator with Reverse Current Protection; AVAILABILITY: Unavailable; DESCRIPTION: Cap-Free, NMOS, 150mA Low Dropout Regulator with Reverse Current Protection 5-SOT-23 -40 to 125; MF: Texas Instruments; MP: TPS73101DBVR; PACKAGE: SOT-23-5 Texas Instruments; PRICE: None
IC9 IC15 = shepherd:LMP7701MF
IC10 = mylib:DAC8562_DGS_10; MANUFACTURER_PART_NUMBER: DAC8562_DGS_10; VENDOR: Texas Instruments
IC11 = mylib:CAT24C256WI-GT3
IC12 = mylib:LM27762DSSR: Low-Noise Positive- and Negative-Output Charge Pump With Integrated LDO 12-WSON -40 to 85; AVAILABILITY: Good; DESCRIPTION: Low-Noise Positive- and Negative-Output Charge Pump With Integrated LDO 12-WSON -40 to 85; MF: Texas Instruments; MP: LM27762DSSR; PACKAGE: WSON-12 Texas Instruments; PRICE: 1.30 USD
IC13 = shepherd:BQ25504_RGT_16
IC14 = mylib:SN74LV4T125PWR
IC16 = mylib:TXB0304RUTR
J1 = shepherd:JST_S4B-ZR-SM4A-TF: CONN HEADER SMD R/A 4POS 1.5MM; AUTOMOTIVE: No; CENTROID_NOT_SPECIFIED: No; CONN_GENDER: Male; CONN_ORIENTATION: Right Angle; CONTACT_MATERIAL: Tin,Copper; CURRENT_RATING: 1A; DATASHEET: http://www.jst-mfg.com/product/pdf/eng/eZH.pdf; DEVICE_CLASS_L1: Connectors; DEVICE_CLASS_L2: Headers and Wire Housings; DEVICE_CLASS_L3: unset; DIGIKEY_DESCRIPTION: CONN HEADER SMD R/A 4POS 1.5MM; DIGIKEY_PART_NUMBER: 455-1695-1-ND; FOOTPRINT_VARIANT_NAME_0: Recommended_Land_Pattern; HEIGHT: 3.7mm; LEAD_FREE: Yes; MF: JST; MFG_PACKAGE_IDENT: S4B-ZR-SM4A-TF; MFG_PACKAGE_IDENT_DATE: 0; MFG_PACKAGE_IDENT_REV: 0; MOUSER_PART_NUMBER: 538-502585-0470; MPN: S4B-ZR-SM4A-TF; NUMBER_OF_CONTACTS: 4; NUMBER_OF_ROWS: 1; PACKAGE: HDR4; PITCH: 1.5mm; PREFIX: J; ROHS: Yes; TEMPERATURE_RANGE_HIGH: +85°C; TEMPERATURE_RANGE_LOW: -25°C; VERIFICATION_VERSION: 0.0.0.2; VOLTAGE_RATING: 50V
JP1 JP2 = pinhead:PINHD-1X2: PIN HEADER
L1 = rcl:L-EU: INDUCTOR, European symbol; SPICEPREFIX: L
LED1-LED4 = mylib:598-8130-107F
P1 = mylib:FE02-2: FEMALE HEADER
P2 = mylib:FE08-2: FEMALE HEADER; OC_FARNELL: unknown; OC_NEWARK: unknown
P3 P4 = mylib:FE04-1: FEMALE HEADER
P8 P9 = mylib:FE23-2: FEMALE HEADER; OC_FARNELL: unknown; OC_NEWARK: unknown
R1-R54 ROK1-ROK3 ROV1 ROV2 RUV1 RUV2 = mylib:R_SMD
S1 = mylib:ADG849YKSZ-REEL
S2 = mylib:ADG736LBRMZ
S3 = mylib:G3VM-31HR: PhotoMOS Relay NAiS Source: Data sheet <http://www.panasonic-electric-works.com/catalogues/downloads/photomos/ds_x615_en_aqv10_20.pdf>; OC_FARNELL: unknown; OC_NEWARK: unknown
S4 = shepherd:TMUX1101DCK
T1-T3 T5-T7 = mylib:SI2374DS
T4 = mylib:SI2307
TP1-TP6 WP = testpad:TPSQ: Test pad